# EAGLE schematic MegaShieldDB (Redesigned) (EAGLE 7.6.0)
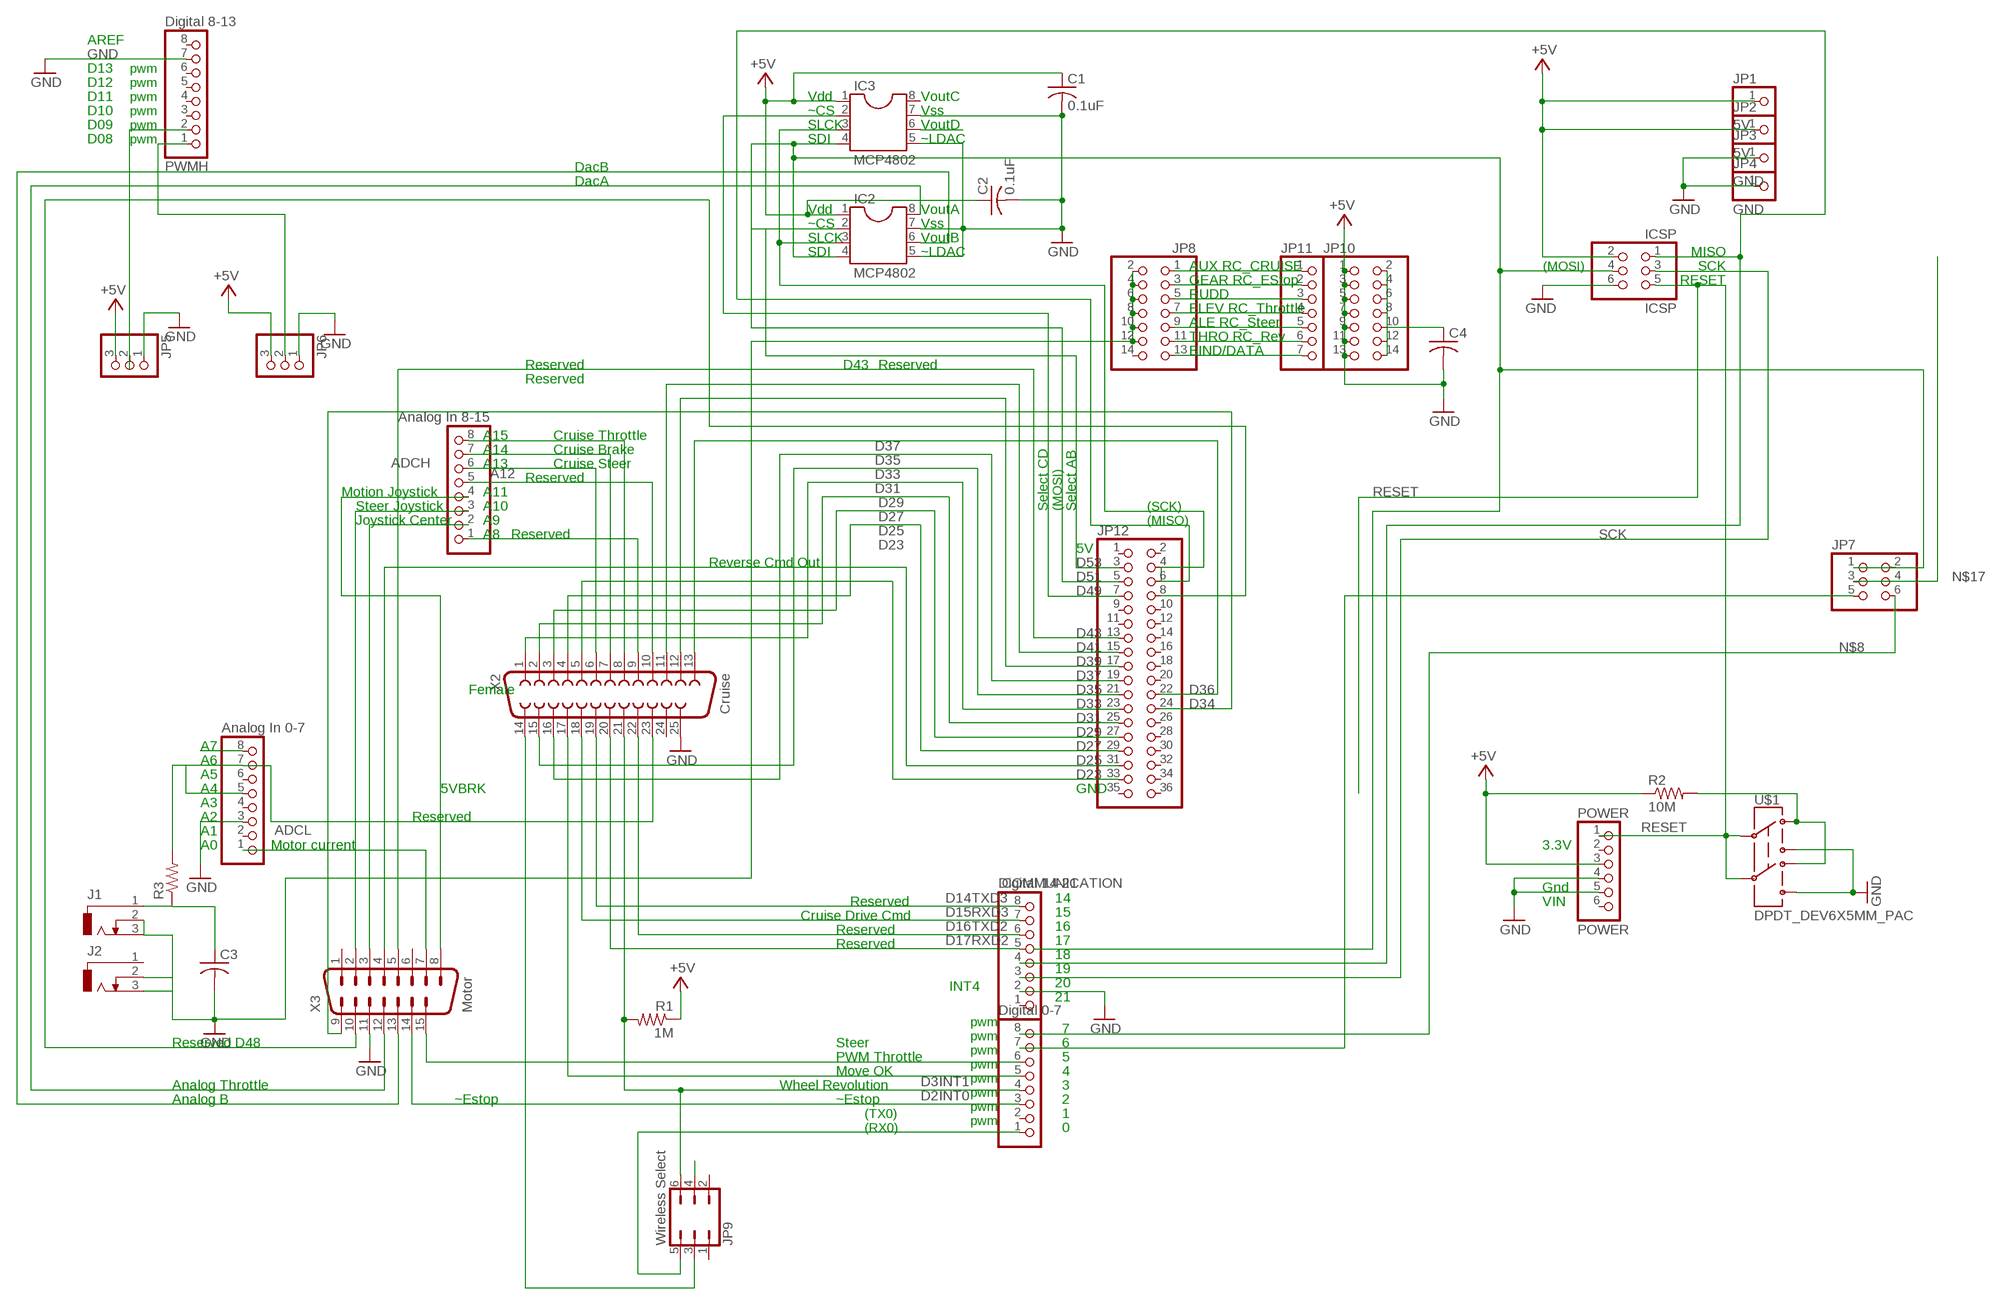
[diagram p0: schematic, sheet 1]

## Parts
ADCH  Analog In 8-15  PINHD-1X8  [1X08]
ADCL  Analog In 0-7  PINHD-1X8  [1X08]
C1  0.1uF  C-US025-025X050  [C025-025X050]
C2  0.1uF  C-US025-025X050  [C025-025X050]
C3  C-US025-025X050  [C025-025X050]
C4  C-US025-030X050  [C025-030X050]
COMMUNICATION  Digital 14-21  PINHD-1X8  [1X08]
IC2  MCP4802  DIL8  [DIL08]
IC3  MCP4802  DIL8  [DIL08]
ICSP  ICSP  PINHD-2X3  [2X03]
J1  DCJ0303  [DCJ0303]
J2  DCJ0303  [DCJ0303]
JP1  5V  PINHD-1X1  [1X01]
JP2  5V  PINHD-1X1  [1X01]
JP3  GND  PINHD-1X1  [1X01]
JP4  GND  PINHD-1X1  [1X01]
JP5  PINHD-1X3  [1X03]
JP6  PINHD-1X3  [1X03]
JP7  PINHD-2X3  [2X03]
JP8  PINHD-2X7  [2X07]
JP9  Wireless Select  JP3Q  [JP3Q]
JP10  PINHD-2X7  [2X07]
JP11  PINHD-1X7  [1X07]
JP12  PINHD-2X18  [2X18]
POWER  POWER  PINHD-1X6  [1X06]
PWMH  Digital 8-13  PINHD-1X8  [1X08]
PWML  Digital 0-7  PINHD-1X8  [1X08]
R1  1M  R-US_0204/5  [0204/5]
R2  10M  R-US_0204/5  [0204/5]
R3  R-US_0207/10  [0207/10]
U$1  DPDT_DEV6X5MM_PAC  [NEWSWITCH2_PAC]
X2  Cruise  F25H  [F25H]
X3  Motor  M15-182  [182-015-MALE]

## Nets
+5V: C1.1 C2.1 C4.2 IC2.1 IC3.1 ICSP.2 JP1.1 JP2.1 JP5.3 JP6.3 JP10.1 JP10.3 JP10.5 JP10.7 JP10.9 JP10.11 JP10.13 POWER.3 R1.1 R2.1 ; supply symbol labelled GND
A0: ADCL.1 X3.7
A6: ADCL.5 ADCL.7 R3.2 X2.23
A7: ADCL.8
A9: ADCH.2 X3.3
A10: ADCH.3 X3.2
A11: ADCH.4 X3.8
A12: ADCH.5 X2.10
A13: ADCH.6 X2.6
A14: ADCH.7 X2.7
A15: ADCH.8 X2.8
D0RX0: JP9.5 PWML.1
D2INT0: PWML.3 X3.14
D3INT1: JP9.6 PWML.4 R1.2 X2.21
D4: PWML.5 X2.17
D5: PWML.6 X3.15
D8: JP6.2 PWMH.1
D9: PWMH.2
D14TXD3: COMMUNICATION.8 X2.19
D15RXD3: COMMUNICATION.7 X2.18
D16TXD2: COMMUNICATION.6 X2.22
D17RXD2: COMMUNICATION.5 X2.20
D23: JP12.33 X2.5
D25: JP12.31 X3.4
D27: JP12.29 X2.4
D29: JP12.27 X2.3
D31: JP12.25 X2.2
D33: JP12.23 X2.1
D34: JP12.24 X3.9
D35: JP12.21 X2.15
D36: JP12.22 X2.13
D37: JP12.19 X2.16
D39: JP12.17 X2.12
D41: JP12.15 X2.11
D43: JP12.13 X3.5
D48: JP12.8 X3.10
D49: IC3.2 JP12.7
D51: IC2.4 IC3.4 ICSP.4 JP7.1 JP12.5
D53: IC2.2 JP12.3
DACA: IC2.8 X3.12
DACB: IC2.6 X3.13
GND: ADCL.3 C1.2 C2.2 C3.2 COMMUNICATION.2 IC2.5 IC2.7 IC3.5 IC3.7 ICSP.6 J1.2 J1.3 J2.2 J2.3 JP3.1 JP4.1 JP5.1 JP6.1 JP8.2 JP8.4 JP8.6 JP8.8 JP8.10 JP8.12 POWER.4 POWER.5 PWMH.7 U$1.PIN3 U$1.PIN6 X2.25 X3.11
N$1: C4.1 JP10.2 JP10.14
N$2: IC2.3 IC3.3
N$3: COMMUNICATION.4 ICSP.1 JP12.6
N$4: IC3.6
N$5: ADCH.1 X2.9
N$6: R2.2 U$1.PIN1 U$1.PIN4
N$7: JP7.5 PWML.7
N$8: JP7.6 PWML.8
N$9: C3.1 J1.1 R3.1
N$10: JP8.1 JP11.1
N$11: JP8.3 JP11.2
N$12: JP8.5 JP11.3
N$13: JP8.7 JP11.4
N$14: JP8.9 JP11.5
N$15: JP8.11 JP11.6
N$16: JP8.13 JP11.7
RESET: ICSP.5 POWER.1 U$1.PIN2 U$1.PIN5
SCK: COMMUNICATION.3 ICSP.3
WL2: JP9.4
X2-14: JP9.3 X2.14
Unconnected: ADCL.2 ADCL.4 ADCL.6 COMMUNICATION.1 IC3.8 J2.1 JP5.2 JP7.2 JP7.3 JP7.4 JP8.14 JP9.1 JP9.2 JP10.4 JP10.6 JP10.8 JP10.10 JP10.12 JP12.1 JP12.2 JP12.4 JP12.9 JP12.10 JP12.11 JP12.12 JP12.14 JP12.16 JP12.18 JP12.20 JP12.26 JP12.28 JP12.30 JP12.32 JP12.34 JP12.35 JP12.36 POWER.2 POWER.6 PWMH.3 PWMH.4 PWMH.5 PWMH.6 PWMH.8 PWML.2 X2.24 X3.1 X3.6

## Notes on the sheet
- AREF
- D13 | pwm
- D12 | pwm
- D11 | pwm | Vdd | VoutC
- D10 | pwm | ~CS | Vss
- D09 | pwm | SLCK | VoutD
- D08 | pwm | SDI | ~LDAC
- DacB
- DacA
- Vdd | VoutA
- ~CS | Vss
- SLCK | VoutB
- SDI | ~LDAC | MISO
- AUX RC_CRUISE | (MOSI) | SCK
- GEAR RC_EStop | RESET
- RUDD
- ELEV RC_Throttle
- ALE RC_Steer
- THRO RC_Rev
- BIND/DATA
- Reserved | D43 | Reserved
- Reserved
- A15 | Cruise Throttle
- A14 | Cruise Brake
- A13 | Cruise Steer
- Reserved
- Motion Joystick | A11
- Steer Joystick | A10 | Select CD | (MOSI) | Select AB | (SCK)
- Joystick Center | A9 | (MISO)
- A8 | Reserved
- 5V
- Reverse Cmd Out
- Female
- A7
- A6
- A5
- A4 | 5VBRK | GND
- A3
- A2 | Reserved
- A1
- A0 | Motor current | 3.3V
- Gnd
- Reserved | 14 | VIN
- Cruise Drive Cmd | 15
- Reserved | 16
- Reserved | 17
- 18
- 19
- INT4 | 20
- 21
- pwm
- 7
- pwm
- Reserved D48 | Steer | 6
- pwm
- PWM Throttle | 5
- pwm
- Move OK | 4
- pwm
- Analog Throttle | Wheel Revolution | 3
- pwm
- Analog B | ~Estop | ~Estop | 2
- pwm
- (TX0) | 1
- pwm
- (RX0) | 0

## Library data of the parts
ADCH ADCL COMMUNICATION PWMH PWML = pinhead:PINHD-1X8: PIN HEADER
C1-C4 = rcl:C-US: CAPACITOR, American symbol
IC2 IC3 = ic-package:DIL8: Dual In Line / Socket
ICSP JP7 = pinhead:PINHD-2X3: PIN HEADER
J1 J2 = con-jack:DCJ0303: DC POWER JACK Source: DCJ0303.pdf; OC_FARNELL: unknown; OC_NEWARK: unknown
JP1-JP4 = pinhead:PINHD-1X1: PIN HEADER
JP5 JP6 = pinhead:PINHD-1X3: PIN HEADER
JP8 JP10 = pinhead:PINHD-2X7: PIN HEADER
JP9 = jumper:JP3Q: JUMPER
JP11 = pinhead:PINHD-1X7: PIN HEADER
JP12 = pinhead:PINHD-2X18: PIN HEADER
POWER = pinhead:PINHD-1X6: PIN HEADER
R1 R2 = rcl:R-US_: RESISTOR, American symbol
R3 = resistor:R-US_: RESISTOR, American symbol
U$1 = elcanoParts:DPDT_DEV
X2 = con-subd:F25: SUB-D; OC_FARNELL: unknown; OC_NEWARK: unknown
X3 = con-subd:M15: SUB-D; OC_FARNELL: unknown; OC_NEWARK: unknown

## Net classes
0 default: width 0.152 mm, drill 0.305 mm, clearance 0.152 mm